# EAGLE design CVT Temp Sensor Board (EAGLE 9.6.2)
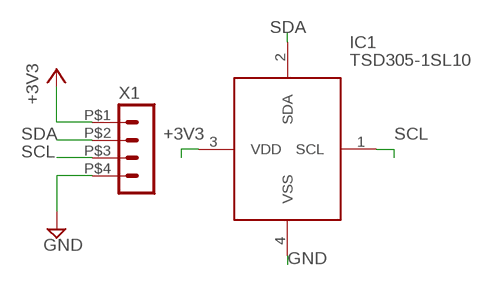
[diagram p0: schematic, sheet 1]

## Parts
IC1  TSD305-1SL10  [TSD3051SL10]
X1  HEADER_POS4_43045-0401  [43045-0400]

## Nets
+3V3: IC1.3(VDD) X1.P$1
GND: IC1.4(VSS) X1.P$4
SCL: IC1.1(SCL) X1.P$3
SDA: IC1.2(SDA) X1.P$2

## Library data of the parts
IC1 = TSD305-1SL10:TSD305-1SL10: Board Mount Temperature Sensors TO5, I2C Interrface 0 C to +300 C Source: Datasheet; DESCRIPTION: Board Mount Temperature Sensors TO5, I2C Interrface 0 C to +300 C; HEIGHT: 8.65mm; MANUFACTURER_NAME: TE Connectivity; MANUFACTURER_PART_NUMBER: TSD305-1SL10; MOUSER_PART_NUMBER: 824-TSD305-1SL10; MOUSER_PRICE-STOCK: https://www.mouser.co.uk/ProductDetail/Measurement-Specialties/TSD305-1SL10?qs=l7cgNqFNU1hQbECGfV0ZYg%3D%3D
X1 = GTOR - Microfit Connector:HEADER_POS4_?: Molex - Micro-Fit 3.0 Series connector, 3.00mm (0.118") pitch header, 4 positions.

## Board
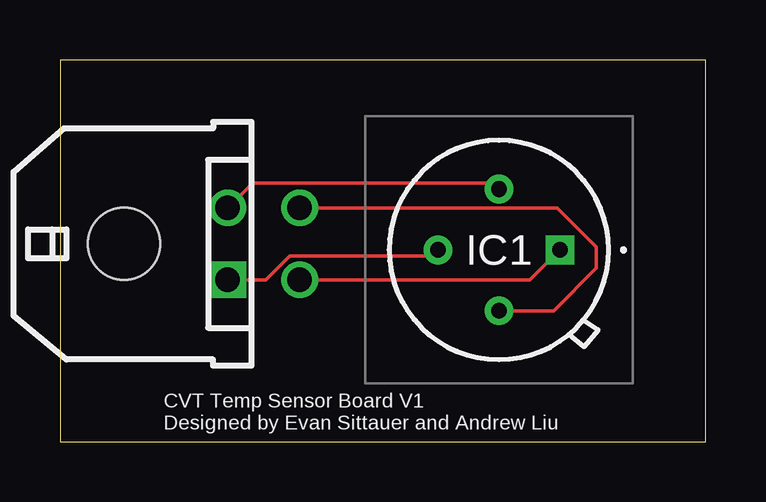
[diagram p1: board, top side]

Size 26.9 x 15.93 mm. Coordinates in mm from the lower left corner, seen from the top.
Outline: 0,0 26.9,0 26.9,15.93 0,15.93 0,0
Copper layers (1*16): Top 0.035mm / dielectric 1.5mm / Bottom 0.035mm
Design rules "default": minimum track width 6mil, minimum drill 0.35mm, track to track 6mil, track to pad 6mil, pad to pad 6mil, via to via 6mil, smd to smd 6mil, copper to edge 40mil, drill to drill 6mil, minimum pad ring 10mil, minimum via ring 8mil, stop-mask expansion 4mil, vias tented up to drill 0mil, thermal gap 10mil

### Footprints (pad centres in the part's own frame; a part is rotated, then mirrored left to right if it is on the bottom)
TSD3051SL10 = drill 0.65 pad 1.192 square: 1 0,0 | drill 0.65 pad 1.192: 2 -2.54,2.54; 3 -5.08,0; 4 -2.54,-2.54
43045-0400 = drill 1.02 square: P$1 1.5,4.32 | drill 1.02: P$2 -1.5,4.32; P$3 1.5,7.32; P$4 -1.5,7.32 | hole 3: 0,0

### Placement (x,y rotation side)
IC1  20.83,8 0 top
X1  2.67,8.25 270 top

### Tracks (layer width: path | path; a pad name or v marks a point on that pad's centre or on a via)
+3V3
  Top 0.152: X1.P$1 8.58,6.75 9.57,7.75 15.5,7.75 IC1.3
GND
  Top 0.152: X1.P$4 20.72,9.75 22.35,8.13 22.35,7.24 20.57,5.46 IC1.4
SCL
  Top 0.152: X1.P$3 19.58,6.75 IC1.1
SDA
  Top 0.152: X1.P$2 8.03,10.8 18.03,10.8 IC1.2

### Text on the board
tNames: CVT Temp Sensor Board V1 / Designed by Evan Sittauer and Andrew Liu